# EAGLE design McPiFace-Status-V1 (EAGLE 7.4.0)
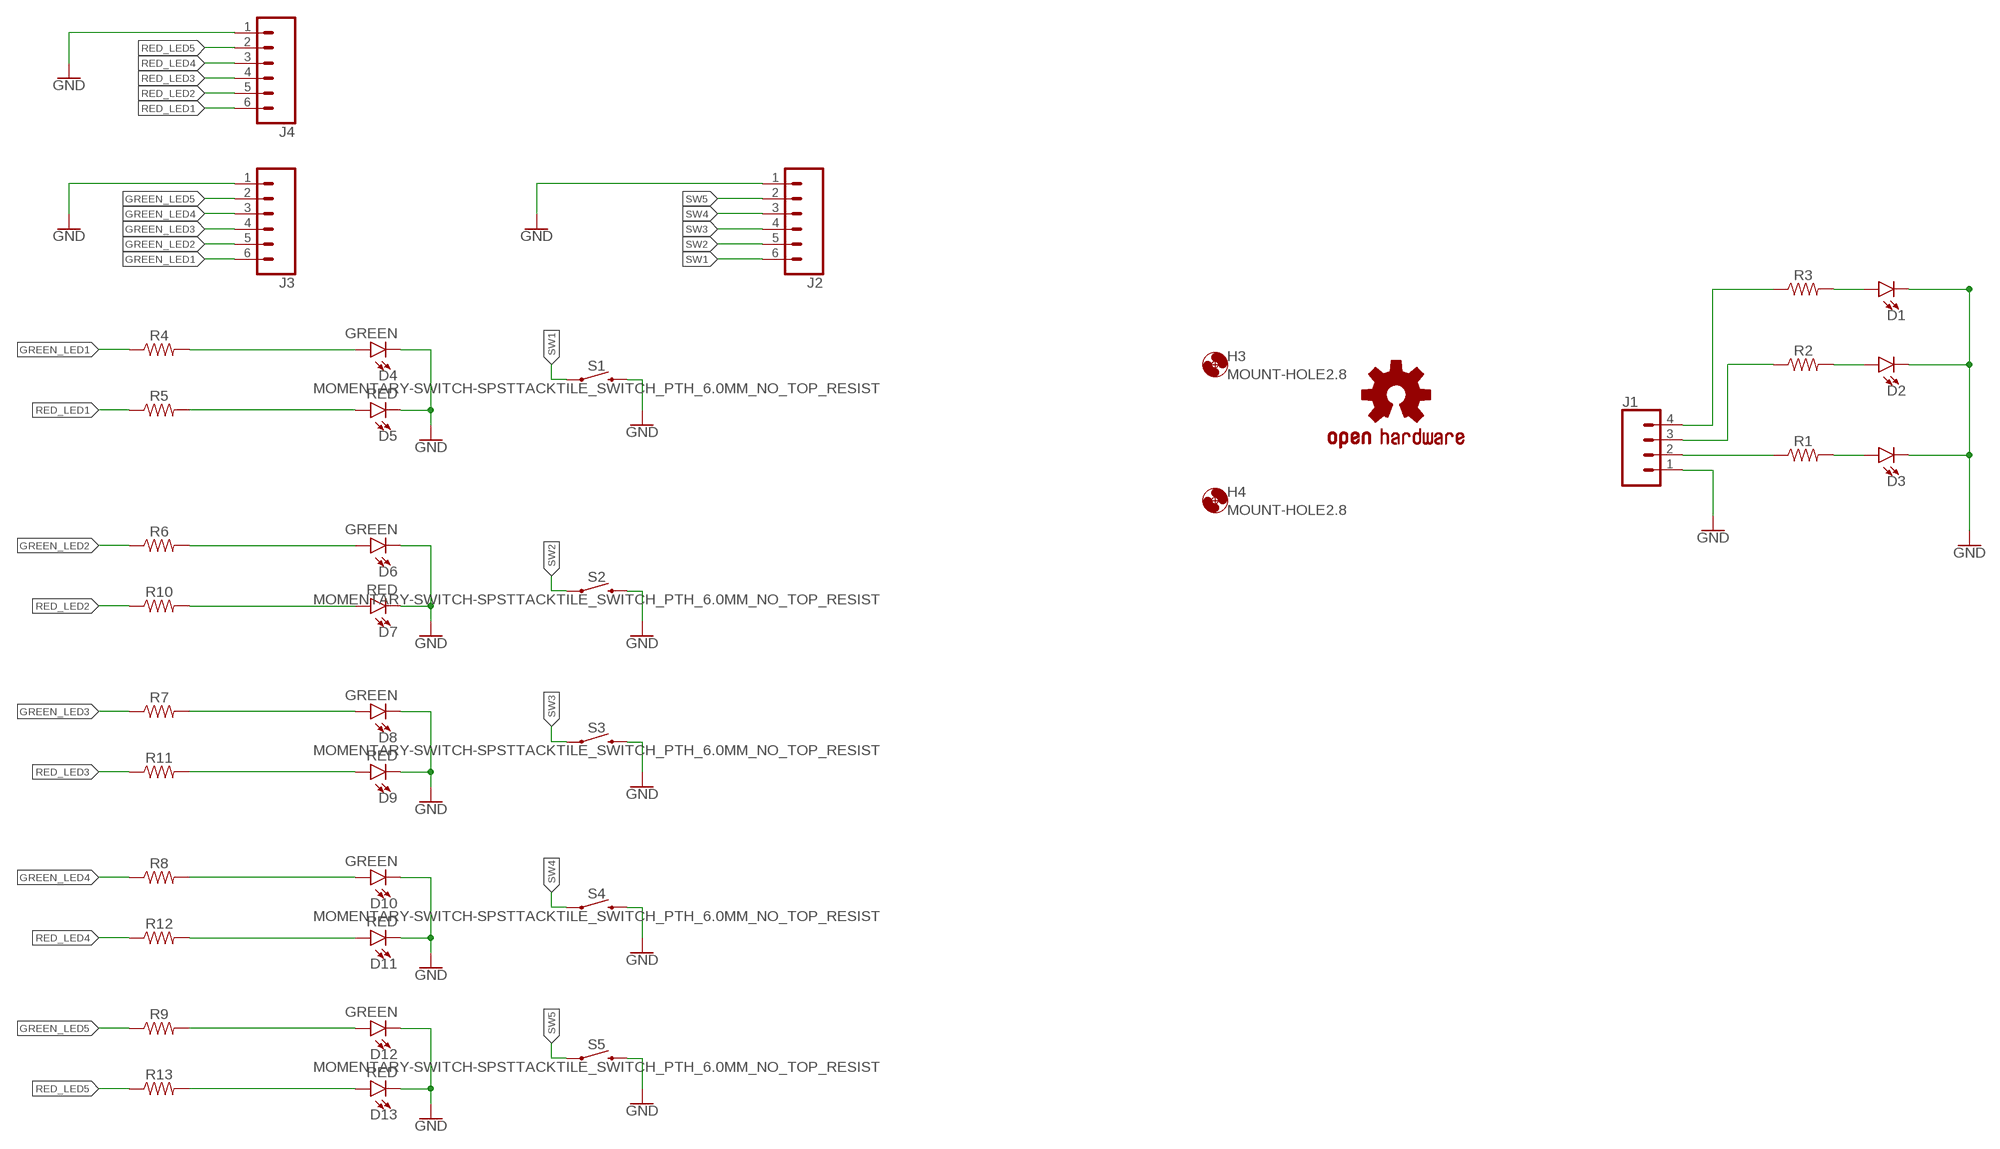
[diagram p0: schematic, sheet 1]

## Parts
D1  LED1206-BOTTOM-1.6MM  [LED-1206-BOTTOM-1.6MM]
D2  LED1206-BOTTOM-1.6MM  [LED-1206-BOTTOM-1.6MM]
D3  LED1206-BOTTOM-1.6MM  [LED-1206-BOTTOM-1.6MM]
D4  GREEN  LED-GREEN1206  [LED-1206]
D5  RED  LED-RED1206  [LED-1206]
D6  GREEN  LED-GREEN1206  [LED-1206]
D7  RED  LED-RED1206  [LED-1206]
D8  GREEN  LED-GREEN1206  [LED-1206]
D9  RED  LED-RED1206  [LED-1206]
D10  GREEN  LED-GREEN1206  [LED-1206]
D11  RED  LED-RED1206  [LED-1206]
D12  GREEN  LED-GREEN1206  [LED-1206]
D13  RED  LED-RED1206  [LED-1206]
H3  MOUNT-HOLE2.8  [2,8]
H4  MOUNT-HOLE2.8  [2,8]
J1  CONN_04SMD2  [1X04_1MM_RA]
J2  CONN_06SMD-1MM  [1X06-1MM]
J3  CONN_06SMD-1MM  [1X06-1MM]
J4  CONN_06SMD-1MM  [1X06-1MM]
LOGO1  OSHW-LOGOL  [OSHW-LOGO-L]
R1  RESISTOR1206  [1206]
R2  RESISTOR1206  [1206]
R3  RESISTOR1206  [1206]
R4  RESISTOR0805  [0805]
R5  RESISTOR0805  [0805]
R6  RESISTOR0805  [0805]
R7  RESISTOR0805  [0805]
R8  RESISTOR0805  [0805]
R9  RESISTOR0805  [0805]
R10  RESISTOR0805  [0805]
R11  RESISTOR0805  [0805]
R12  RESISTOR0805  [0805]
R13  RESISTOR0805  [0805]
S1  MOMENTARY-SWITCH-SPSTTACKTILE_SWITCH_PTH_6.0MM_NO_TOP_RESIST  [TACTILE_SWITCH_PTH_6.0MM_NO_TOP_RESIST]
S2  MOMENTARY-SWITCH-SPSTTACKTILE_SWITCH_PTH_6.0MM_NO_TOP_RESIST  [TACTILE_SWITCH_PTH_6.0MM_NO_TOP_RESIST]
S3  MOMENTARY-SWITCH-SPSTTACKTILE_SWITCH_PTH_6.0MM_NO_TOP_RESIST  [TACTILE_SWITCH_PTH_6.0MM_NO_TOP_RESIST]
S4  MOMENTARY-SWITCH-SPSTTACKTILE_SWITCH_PTH_6.0MM_NO_TOP_RESIST  [TACTILE_SWITCH_PTH_6.0MM_NO_TOP_RESIST]
S5  MOMENTARY-SWITCH-SPSTTACKTILE_SWITCH_PTH_6.0MM_NO_TOP_RESIST  [TACTILE_SWITCH_PTH_6.0MM_NO_TOP_RESIST]

## Nets
GND: D1.C D2.C D3.C D4.C D5.C D6.C D7.C D8.C D9.C D10.C D11.C D12.C D13.C J1.1 J2.1 J3.1 J4.1 S1.3 S2.3 S3.3 S4.3 S5.3
GREEN_LED1: J3.6 R4.1
GREEN_LED2: J3.5 R6.1
GREEN_LED3: J3.4 R7.1
GREEN_LED4: J3.3 R8.1
GREEN_LED5: J3.2 R9.1
N$1: D4.A R4.2
N$2: D1.A R3.2
N$3: D2.A R2.2
N$4: D3.A R1.2
N$5: J1.2 R1.1
N$6: J1.3 R2.1
N$7: J1.4 R3.1
N$8: D6.A R6.2
N$9: D12.A R9.2
N$10: D10.A R8.2
N$11: D8.A R7.2
N$12: D5.A R5.2
N$13: D7.A R10.2
N$14: D9.A R11.2
N$15: D11.A R12.2
N$16: D13.A R13.2
RED_LED1: J4.6 R5.1
RED_LED2: J4.5 R10.1
RED_LED3: J4.4 R11.1
RED_LED4: J4.3 R12.1
RED_LED5: J4.2 R13.1
SW1: J2.6 S1.1
SW2: J2.5 S2.1
SW3: J2.4 S3.1
SW4: J2.3 S4.1
SW5: J2.2 S5.1

## Library data of the parts
D1-D3 = ThingySticks:LED: LED (Generic) Standard schematic elements and footprints for 5mm, 3mm, 1206, and 0603 sized LEDs. Generic LEDs with no color specified.
D4 D6 D8 D10 D12 = SparkFun-LED:LED-GREEN: Green SMD LED Used in manufacturing of various products at SparkFun Packages: 0603 - SMD 0603 package [Product Link] <http://www.futureelectronics.com/en/technologies/semiconductors/optoelectronics/leds/Pages/9894312-LTST-C190GKT.aspx?CrossPart=HSMG-C190&IM=0> LilyPad 1206 - SMD1206 LilyPad package [Product Link] <http://www.futureelectronics.com/en/Technologies/Product.aspx?ProductID=IN150NGHARVATEKCORPORATION2049943&IM=0> 1206 - SMD1206 package [Product Link] <http://www.futureelectronics.com/en/technologies/semiconductors/optoelectronics/leds/Pages/8315665-LTST-C150KGKT.aspx?IM=0> 1206 Bottom Mount -SMD 1206 Bottom Mount [Product Link] <http://www.digikey.com/product-detail/en/lite-on-inc/LTST-C230KGKT/160-1456-1-ND/386854> SparkFun Products: Pro Mini 328 -5V <https://www.sparkfun.com/products/821> RedBoard <https://www.sparkfun.com/products/12757> MP3 Trigger <https://www.sparkfun.com/products/13720> Makey Makey <https://www.sparkfun.com/products/11076>; PROD_ID: DIO-00862
D5 D7 D9 D11 D13 = SparkFun-LED:LED-RED: Red SMD LED Used in manufacturing of most products at SparkFun Packages: 0603 - SMD 0603 package [Product Link] <http://docs.avagotech.com/docs/AV02-0551EN> 0603 SMART - SMD 0603 SMART package ( more efficient and expensive)[Product Link] <http://www.osram-os.com/Graphics/XPic2/00077099_0.pdf> 1206 - SMD1206 package [Product Link] <https://www.sparkfun.com/datasheets/DevTools/LilyPad/Q150OVS4.pdff> SparkFun Products: Pro Mini 328 -5V <https://www.sparkfun.com/products/821> RedBoard <https://www.sparkfun.com/products/12757> IOIO-OTG <https://www.sparkfun.com/products/13613>; PROD_ID: DIO-09912
H3 H4 = holes:MOUNT-HOLE: MOUNTING HOLE with drill center marker
J1 = SparkFun-Connectors:CONN_04: Multi connection point. Often used as Generic Header-pin footprint for 0.1 inch spaced/style header connections On any of the 0.1 inch spaced packages, you can populate with these: Break Away Headers - Straight <https://www.sparkfun.com/products/116> (PRT-00116) Break Away Male Headers - Right Angle <https://www.sparkfun.com/products/553> (PRT-00553) Female Headers <https://www.sparkfun.com/products/115> (PRT-00115) Break Away Headers - Machine Pin <https://www.sparkfun.com/products/117> (PRT-00117) Break Away Female Headers - Swiss Machine Pin <https://www.sparkfun.com/products/743> (PRT-00743) For SCREWTERMINALS and SPRING TERMINALS visit here: Screw Terimnals on SparkFun.com <https://www.sparkfun.com/search/results?term=Screw+Terminals> (5mm/3.5mm/2.54mm spacing) This device is also useful as a general connection point to wire up your design to another part of your project. Our various solder wires solder well into these plated through hole pads. Hook-Up Wire - Assortment (Stranded, 22 AWG) <https://www.sparkfun.com/products/11375> (PRT-11375) Hook-Up Wire - Assortment (Solid Core, 22 AWG) <https://www.sparkfun.com/products/11367> (PRT-11367) View the entire wire category on our website here <https://www.sparkfun.com/categories/141> Special notes: Molex polarized connector foot print use with SKU : PRT-08231 with associated crimp pins and housings. 1MM SMD Version SKU: PRT-10208; PROD_ID: CONN-10310; SF_ID: PRT-10208
J2-J4 = SparkFun-Connectors:CONN_06: Multi connection point. Often used as Generic Header-pin footprint for 0.1 inch spaced/style header connections On any of the 0.1 inch spaced packages, you can populate with these: Break Away Headers - Straight <https://www.sparkfun.com/products/116> (PRT-00116) Break Away Male Headers - Right Angle <https://www.sparkfun.com/products/553> (PRT-00553) Female Headers <https://www.sparkfun.com/products/115> (PRT-00115) Break Away Headers - Machine Pin <https://www.sparkfun.com/products/117> (PRT-00117) Break Away Female Headers - Swiss Machine Pin <https://www.sparkfun.com/products/743> (PRT-00743) Arduino Stackable Header - 6 Pin <https://www.sparkfun.com/products/9280> (PRT-09280) For SCREWTERMINALS and SPRING TERMINALS visit here: Screw Terimnals on SparkFun.com <https://www.sparkfun.com/search/results?term=Screw+Terminals> (5mm/3.5mm/2.54mm spacing) This device is also useful as a general connection point to wire up your design to another part of your project. Our various solder wires solder well into these plated through hole pads. Hook-Up Wire - Assortment (Stranded, 22 AWG) <https://www.sparkfun.com/products/11375> (PRT-11375) Hook-Up Wire - Assortment (Solid Core, 22 AWG) <https://www.sparkfun.com/products/11367> (PRT-11367) View the entire wire category on our website here <https://www.sparkfun.com/categories/141>; PROD_ID: CONN-08249; SF_ID: GPS-00579
LOGO1 = SparkFun-Aesthetics:OSHW-LOGO: Open-Source Hardware (OSHW) Logo This logo indicates the piece of hardware it is found on incorporates a OSHW license and/or adheres to the definition of open source hardware found here: http://freedomdefined.org/OSHW
R1-R13 = SparkFun-Resistors:RESISTOR: Generic Resistor Package
S1-S5 = ThingySticks:MOMENTARY-SWITCH-SPST: Momentary Switch (Pushbutton) - SPST Normally-open (NO) SPST momentary switches (buttons, pushbuttons). Variants PTH-12MM - 12mm square, through-hole Momentary Pushbutton Switch - 12mm Square <https://www.sparkfun.com/products/9190> (COM-09190) PTH-6.0MM, PTH-6.0MM-KIT - 6.0mm square, through-hole Mini Pushbutton Switch <https://www.sparkfun.com/products/97> (COM-00097) KIT package intended for soldering kit's - only one side of pads' copper is exposed. PTH-RIGHT-ANGLE-KIT - Right-angle, through-hole Right Angle Tactile Button <https://www.sparkfun.com/products/10791> - Used on SparkFun BigTime Watch Kit <https://www.sparkfun.com/products/11734> SMD-12MM - 12mm square, surface-mount Tactile Button - SMD (12mm) <https://www.sparkfun.com/products/12993> (COM-12993) Used on SparkFun PicoBoard <https://www.sparkfun.com/products/11888> SMD-4.5MM - 4.5mm Square Trackball Switch Used on SparkFun Blackberry Trackballer Breakout <https://www.sparkfun.com/products/13169> SMD-4.6MMX2.8MM - 4.60mm x 2.80mm, surface mount Used on SparkFun SAMD21 Mini Breakout <https://www.sparkfun.com/products/13664> SMD-5.2MM, SMD-5.2-REDUNDANT - 5.2mm square, surface-mount Mini Pushbutton Switch - SMD <https://www.sparkfun.com/products/8720> (COM-08720) Used on Arduino Pro Mini <https://www.sparkfun.com/products/11114> REDUNDANT package connects both switch circuits together SMD-6.0X3.5MM - 6.0 x 3.5mm, surface mount Momentary Reset Switch SMD <https://www.sparkfun.com/products/8229> (COM-08229) SMD-6.2MM-TALL - 6.2mm square, surface mount Tactile Button - SMD (6mm) <https://www.sparkfun.com/products/12992> Used on SparkFun Digital Sandbox <https://www.sparkfun.com/products/12651> SMD-RIGHT-ANGLE - Right-angle, surface mount Used on SparkFun Block for Intel® Edison - Arduino <https://www.sparkfun.com/products/13036>

## Board
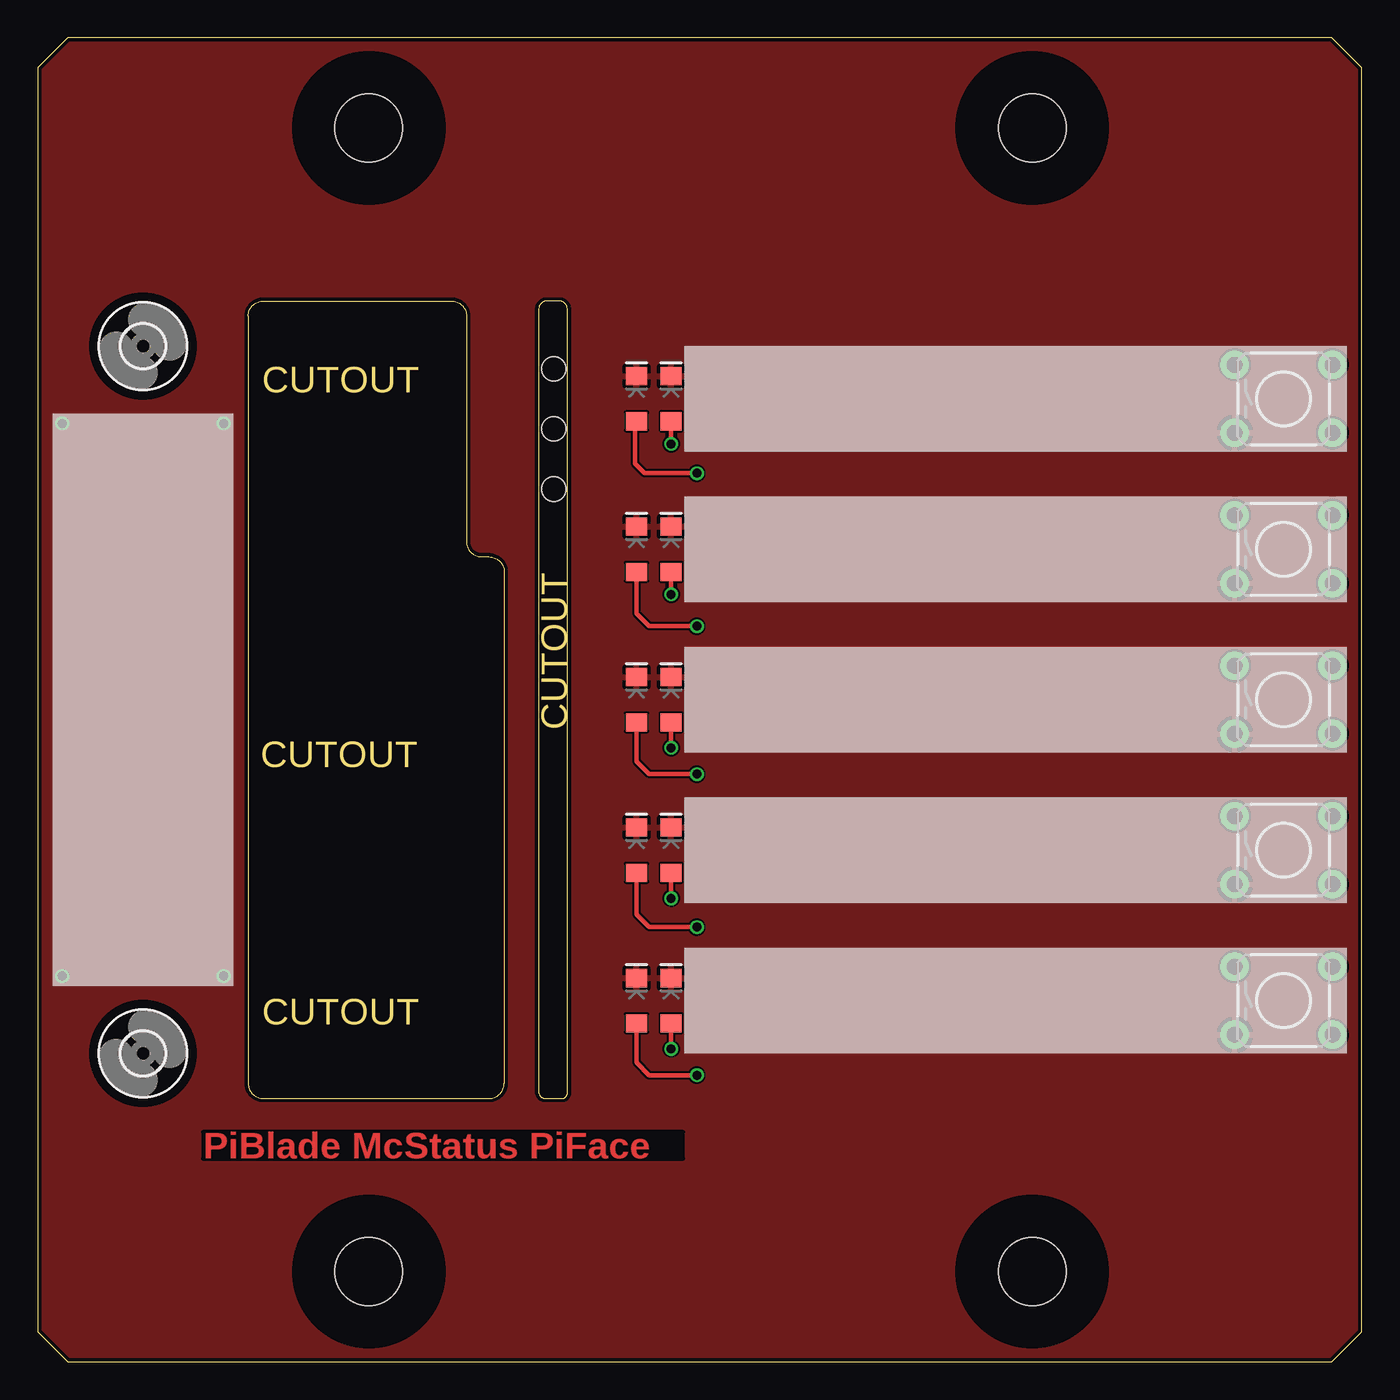
[diagram p1: board, top side]
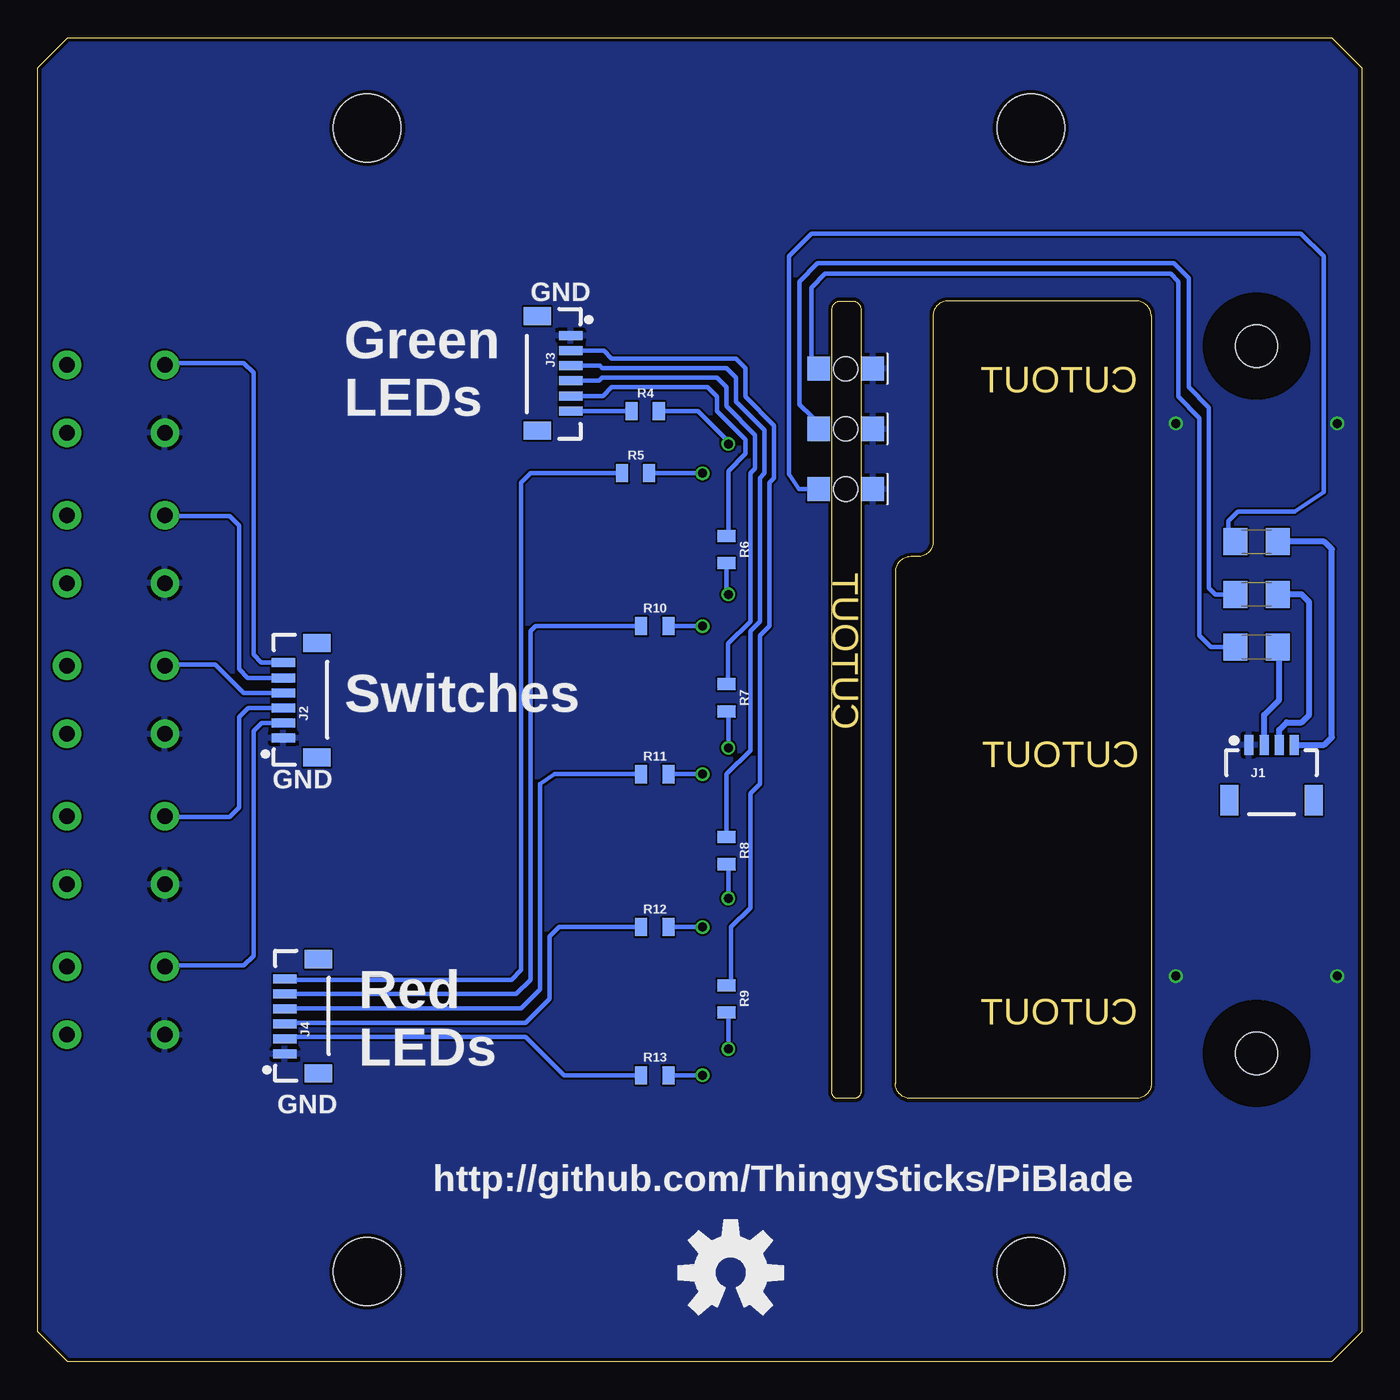
[diagram p2: board, bottom side, seen from below]

Size 88 x 88 mm. Coordinates in mm from the lower left corner, seen from the top.
Outline: 2,0 86,0 88,2 88,86 86,88 2,88 0,86 0,2 2,0
Outline: 14,69.5 14,18.5 arc90 15,17.5 30,17.5 arc90 31,18.5 31,52.5 arc90 30,53.5 29.5,53.5 arc-90 28.5,54.5 28.5,69.5 arc90 27.5,70.5 15,70.5 arc90 14,69.5
Outline: 33.3,18 arc90 33.7,17.5 34.9,17.5 arc90 35.2,18 35.2,70 arc90 34.6,70.5 33.8,70.5 arc90 33.3,69.9 33.3,18
Copper layers (1*16): Top 0.035mm / dielectric 1.5mm / Bottom 0.035mm
Design rules "dirt_cheap_dirty_boards.v1": minimum track width 5mil, minimum drill 12mil, track to track 5mil, track to pad 5mil, pad to pad 5mil, via to via 5mil, smd to smd 0mil, copper to edge 10mil, drill to drill 10mil, minimum pad ring 10mil, minimum via ring 6mil, stop-mask expansion 2mil, vias tented up to drill 25mil, thermal gap 10mil
Holes 4.5 mm at 22,6 22,82 66.1,82 66.1,6
tRestrict: area 17,77 to 27,87; area 17,1 to 27,11; area 61.1,1 to 71.1,11; area 61.1,77 to 71.1,87

### Footprints (pad centres in the part's own frame; a part is rotated, then mirrored left to right if it is on the bottom)
LED-1206-BOTTOM-1.6MM = smd 1.5 x 1.6: A -1.8,0; C 1.8,0 | hole 1.6: 0,0
LED-1206 = smd 1.2 x 1.4: A -1.5,0; C 1.5,0
2,8 = hole 2.8: 0,0
1X04_1MM_RA = smd 0.6 x 1.35: 1 -1.5,0; 2 -0.5,0; 3 0.5,0; 4 1.5,0 | smd 1.2 x 2: NC1 2.8,-3.675; NC2 -2.8,-3.675
1X06-1MM = smd 0.6 x 1.55: 1 -2.54,1.27; 2 -1.54,1.27; 3 -0.54,1.27; 4 0.46,1.27; 5 1.46,1.27; 6 2.46,1.27 | smd 1.2 x 1.8: P$1 -3.84,-0.955; P$2 3.76,-0.955
1206 = smd 1.6 x 1.8: 1 -1.4,0; 2 1.4,0
0805 = smd 0.8 x 1.2: 1 -0.9,0; 2 0.9,0
TACTILE_SWITCH_PTH_6.0MM_NO_TOP_RESIST = drill 1.016 pad 1.88: 1 -3.251,2.261; 2 3.251,2.261; 3 -3.251,-2.261; 4 3.251,-2.261

### Placement (x,y rotation side)
D1  34.3,58 0 bottom
D2  34.3,62 0 bottom
D3  34.3,66 0 bottom
D4  42.1,64 90 top
D5  39.8,64 90 top
D6  42.1,54 90 top
D7  39.8,54 90 top
D8  42.1,44 90 top
D9  39.8,44 90 top
D10  42.1,34 90 top
D11  39.8,34 90 top
D12  42.1,24 90 top
D13  39.8,24 90 top
H3  7,20.5 0 top
H4  7,67.5 0 top
J1  6,41 0 bottom
J2  70.4,44 90 bottom
J3  53.84,65.65 270 bottom
J4  70.3,23 90 bottom
LOGO1  41.94,5.92 0 bottom
R1  7,47.5 180 bottom
R2  7,51 180 bottom
R3  7,54.5 180 bottom
R4  47.62,63.18 0 bottom
R5  48.26,59.05 0 bottom
R6  42.23,53.98 270 bottom
R7  42.23,44.13 270 bottom
R8  42.23,33.97 270 bottom
R9  42.23,24.13 270 bottom
R10  46.99,48.9 0 bottom
R11  46.99,39.05 0 bottom
R12  46.99,28.89 0 bottom
R13  46.99,19.05 0 bottom
S1  82.8,64 0 top
S2  82.8,54 0 top
S3  82.8,44 0 top
S4  82.8,34 0 top
S5  82.8,24 0 top

### Tracks (layer width: path | path; a pad name or v marks a point on that pad's centre or on a via)
GND  (via drill 0.6, 0.6 pad 0.25)
  other vias: 1.64,62.37 12.37,62.37 1.64,25.64 12.37,25.64
  pour Top: -1,88.5 88.7,88.5 88.7,-1 -1,-1
  pour Bottom: -1,88.5 88.7,88.5 88.7,-1 -1,-1
GREEN_LED1
  Bottom 0.305: J3.6 R4.1
GREEN_LED2
  Bottom 0.305: J3.5 50.42,64.19 49.85,64.77 43.5,64.77 42.86,64.14 42.86,63.18 40.96,61.28 40.96,60.34 42.1,59.2 42.1,55 R6.1
GREEN_LED3
  Bottom 0.305: J3.4 50.7,65.19 50.48,65.41 42.86,65.41 42.23,64.77 42.23,63.5 40.32,61.59 40.32,59.37 40.64,59.05 40.64,49.21 42.13,47.73 42.13,45.13 R7.1
GREEN_LED4
  Bottom 0.305: J3.3 50.63,66.19 50.48,66.04 42.23,66.04 41.59,65.41 41.59,63.82 39.69,61.91 39.69,59.05 40.01,58.74 40.01,49.21 40.64,48.58 40.64,40.64 42.23,39.05 R8.1
GREEN_LED5
  Bottom 0.305: J3.2 50.37,67.19 49.85,66.67 41.59,66.67 40.96,66.04 40.96,64.14 39.05,62.23 39.05,58.74 39.37,58.42 39.37,48.9 40.01,48.26 40.01,38.42 40.64,37.78 40.64,30.16 41.91,28.89 41.91,25.35 R9.1
N$1  (via drill 0.6)
  Top 0.305: D4.A v42.1,61
  Bottom 0.305: v42.1,61 42.1,61.15 44.13,63.18 R4.2
N$2
  Bottom 0.305: D1.A 37.4,58 38.08,59 38.08,73.47 36.58,74.97 4.04,74.97 2.54,73.47 2.54,57.78 4.45,56.52 8.26,56.52 8.89,55.88 8.89,54.5 R3.2
N$3
  Bottom 0.305: 35.78,62.1 37.38,63.6 37.38,71.8 36.18,73 12.5,73 11.5,72 11.5,64.77 10.16,63.43 10.16,51.44 9.72,51 R2.2
  Bottom 0.406: D2.A 35.78,62.1
N$4
  Bottom 0.305: 36.5,66 36.58,66.4 36.58,71.4 35.68,72.3 12.7,72.3 12.2,71.8 12.2,64.14 10.79,62.73 10.79,48.26 10.04,47.5 R1.2
  Bottom 0.406: 35.9,66 D3.A 36.5,66
N$5
  Bottom 0.406: J1.2 6.5,43 5.5,44 5.5,47.4 R1.1
N$6
  Bottom 0.406: J1.3 5.5,42 5,42.5 4,42.5 3.5,43 3.5,50.5 4,51 R2.1
N$7
  Bottom 0.406: J1.4 2.5,41 2,41.5 2,54 2.5,54.5 R3.1
N$8  (via drill 0.6)
  Top 0.305: v42.1,51 D6.A
  Bottom 0.305: R6.2 42.23,51.12 42.22,51.12 v42.1,51
N$9  (via drill 0.6)
  Top 0.305: D12.A v42.1,20.8
  Bottom 0.305: v42.1,20.8 42.1,23.1 R9.2
N$10  (via drill 0.6)
  Top 0.305: D10.A v42.1,30.8
  Bottom 0.305: v42.1,30.8 42.1,32.95 R8.2
N$11  (via drill 0.6)
  Top 0.305: D8.A v42.1,40.8
  Bottom 0.305: v42.1,40.8 42.1,43.1 R7.2
N$12  (via drill 0.6)
  Top 0.305: v43.81,59.05 40.32,59.05 39.69,59.69 39.69,62.39 D5.A
  Bottom 0.305: R5.2 v43.81,59.05
N$13  (via drill 0.6)
  Top 0.305: D7.A 39.8,49.73 40.64,48.9 v43.81,48.9
  Bottom 0.305: v43.81,48.9 R10.2
N$14  (via drill 0.6)
  Top 0.305: D9.A 39.8,39.89 40.64,39.05 v43.81,39.05
  Bottom 0.305: v43.81,39.05 R11.2
N$15  (via drill 0.6)
  Top 0.305: D11.A 39.8,29.73 40.64,28.89 v43.81,28.89
  Bottom 0.305: v43.81,28.89 R12.2
N$16  (via drill 0.6)
  Top 0.305: D13.A 39.8,19.89 40.64,19.05 v43.81,19.05
  Bottom 0.305: v43.81,19.05 R13.2
RED_LED1
  Bottom 0.305: J4.6 71.51,25.4 56.52,25.4 55.88,26.04 55.88,58.42 55.24,59.05 R5.1
RED_LED2
  Bottom 0.305: J4.5 71.56,24.45 56.2,24.45 55.24,25.4 55.24,48.58 54.93,48.9 R10.1
RED_LED3
  Bottom 0.305: J4.4 71.53,23.5 55.88,23.5 54.61,24.77 54.61,38.42 53.66,39.05 R11.1
RED_LED4
  Bottom 0.305: J4.3 71.49,22.54 55.56,22.54 53.98,24.13 53.98,28.26 53.34,28.89 R12.1
RED_LED5
  Bottom 0.305: 71.53,21.5 J4.2 71.44,21.59 55.56,21.59 53.02,19.05 R13.1
SW1
  Bottom 0.305: J2.6 73.13,46.46 73.66,46.99 73.66,65.72 74.3,66.36 79.45,66.36 S1.1
SW2
  Bottom 0.305: J2.5 74.03,45.46 74.61,46.04 74.61,55.56 75.25,56.2 79.49,56.2 S2.1
SW3
  Bottom 0.305: J2.4 74.31,44.46 76.2,46.35 79.45,46.35 S3.1
SW4
  Bottom 0.305: J2.3 74.02,43.46 74.61,42.86 74.61,36.83 75.25,36.2 79.48,36.2 S4.1
SW5
  Bottom 0.305: J2.2 73.11,42.46 73.66,41.91 73.66,26.99 74.3,26.35 79.46,26.35 S5.1

### Text on the board
Top: PiBlade McStatus PiFace
Dimension: CUTOUT | CUTOUT | CUTOUT | CUTOUT
bNames: GND | Green / LEDs | Switches | GND | Red / LEDs | GND | http://github.com/ThingySticks/PiBlade
tStop: STATUS